# EAGLE schematic mcat-4cu-b-v2b (EAGLE 6.5.0)

## Sheet 1 of 5
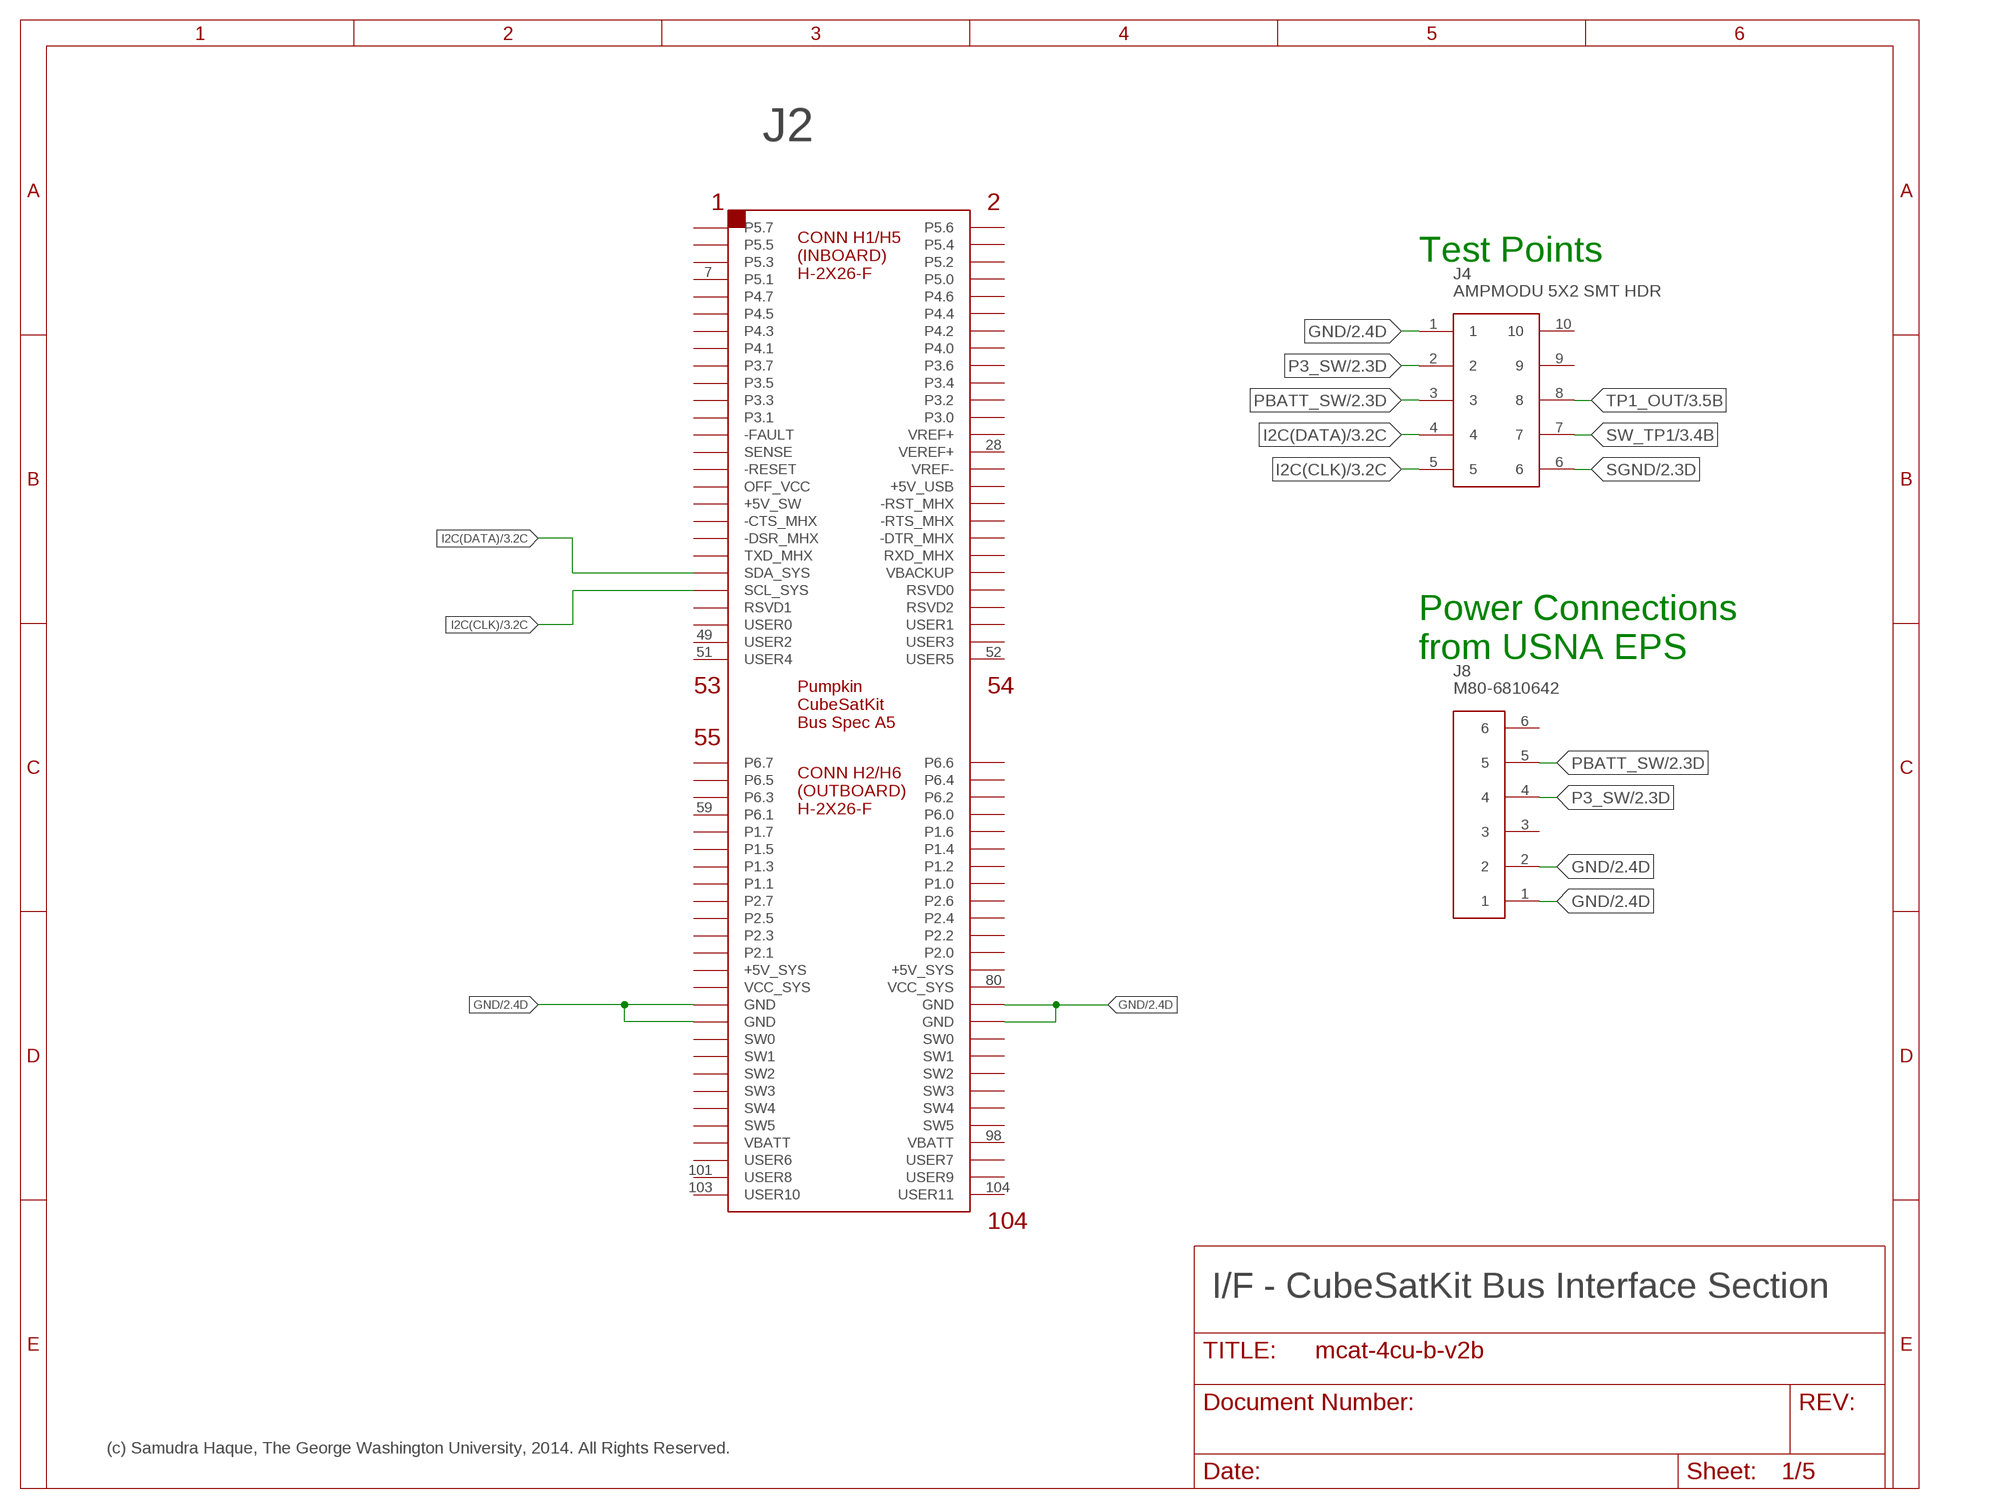
[diagram p0: schematic, sheet 1]

### Parts
J2  CSK-BUS-CONN2X2X26  [CSK-BUS-PKG]
J4  AMPMODU 5X2 SMT HDR  AMPMODU-5-146131-X(5X2)  [AMPMODU-SMT-PIN-HEADER-5X2]
J8  M80-6810642  [M80-68106]

### Nets
GND: J2.81(GND) J2.82(GND) J2.83(GND) J2.84(GND) J4.1 J8.1 J8.2 ; also sheet 2,3
I2C(CLK): J2.43(SCL_SYS) J4.5 ; also sheet 3
I2C(DATA): J2.41(SDA_SYS) J4.4 ; also sheet 3
P3_SW: J4.2 J8.4 ; also sheet 2
PBATT_SW [vin2a2ozcu]: J4.3 J8.5 ; also sheet 2
SGND: J4.6 ; also sheet 2,3,4,5
SW_TP1: J4.7 ; also sheet 3
TP1_OUT: J4.8 ; also sheet 3,5
Unconnected: J2.1(P5.7) J2.2(P5.6) J2.3(P5.5) J2.4(P5.4) J2.5(P5.3) J2.6(P5.2) J2.7(P5.1) J2.8(P5.0) J2.9(P4.7) J2.10(P4.6) J2.11(P4.5) J2.12(P4.4) J2.13(P4.3) J2.14(P4.2) J2.15(P4.1) J2.16(P4.0) J2.17(P3.7) J2.18(P3.6) J2.19(P3.5) J2.20(P3.4) J2.21(P3.3) J2.22(P3.2) J2.23(P3.1) J2.24(P3.0) J2.25(-FAULT) J2.26(VREF+) J2.27(SENSE) J2.28(VEREF+) J2.29(-RESET) J2.30(VREF-) J2.31(OFF_VCC) J2.32(+5V_USB) J2.33(+5V_SW) J2.34(-RST_MHX) J2.35(-CTS_MHX) J2.36(-RTS_MHX) J2.37(-DSR_MHX) J2.38(-DTR_MHX) J2.39(TXD_MHX) J2.40(RXD_MHX) J2.42(VBACKUP) J2.44(RSVD0) J2.45(RSVD1) J2.46(RSVD2) J2.47(USER0) J2.48(USER1) J2.49(USER2) J2.50(USER3) J2.51(USER4) J2.52(USER5) J2.53(P6.7) J2.54(P6.6) J2.55(P6.5) J2.56(P6.4) J2.57(P6.3) J2.58(P6.2) J2.59(P6.1) J2.60(P6.0) J2.61(P1.7) J2.62(P1.6) J2.63(P1.5) J2.64(P1.4) J2.65(P1.3) J2.66(P1.2) J2.67(P1.1) J2.68(P1.0) J2.69(P2.7) J2.70(P2.6) J2.71(P2.5) J2.72(P2.4) J2.73(P2.3) J2.74(P2.2) J2.75(P2.1) J2.76(P2.0) J2.77(+5V_SYS) J2.78(+5V_SYS) J2.79(VCC_SYS) J2.80(VCC_SYS) J2.85(SW0) J2.86(SW0) J2.87(SW1) J2.88(SW1) J2.89(SW2) J2.90(SW2) J2.91(SW3) J2.92(SW3) J2.93(SW4) J2.94(SW4) J2.95(SW5) J2.96(SW5) J2.97(VBATT) J2.98(VBATT) J2.99(USER6) J2.100(USER7) J2.101(USER8) J2.102(USER9) J2.103(USER10) J2.104(USER11) J4.9 J4.10 J8.3 J8.6

### Notes on the sheet
- Test Points
- Power Connections
  from USNA EPS
- I/F - CubeSatKit Bus Interface Section
- (c) Samudra Haque, The George Washington University, 2014. All Rights Reserved.

## Sheet 2 of 5
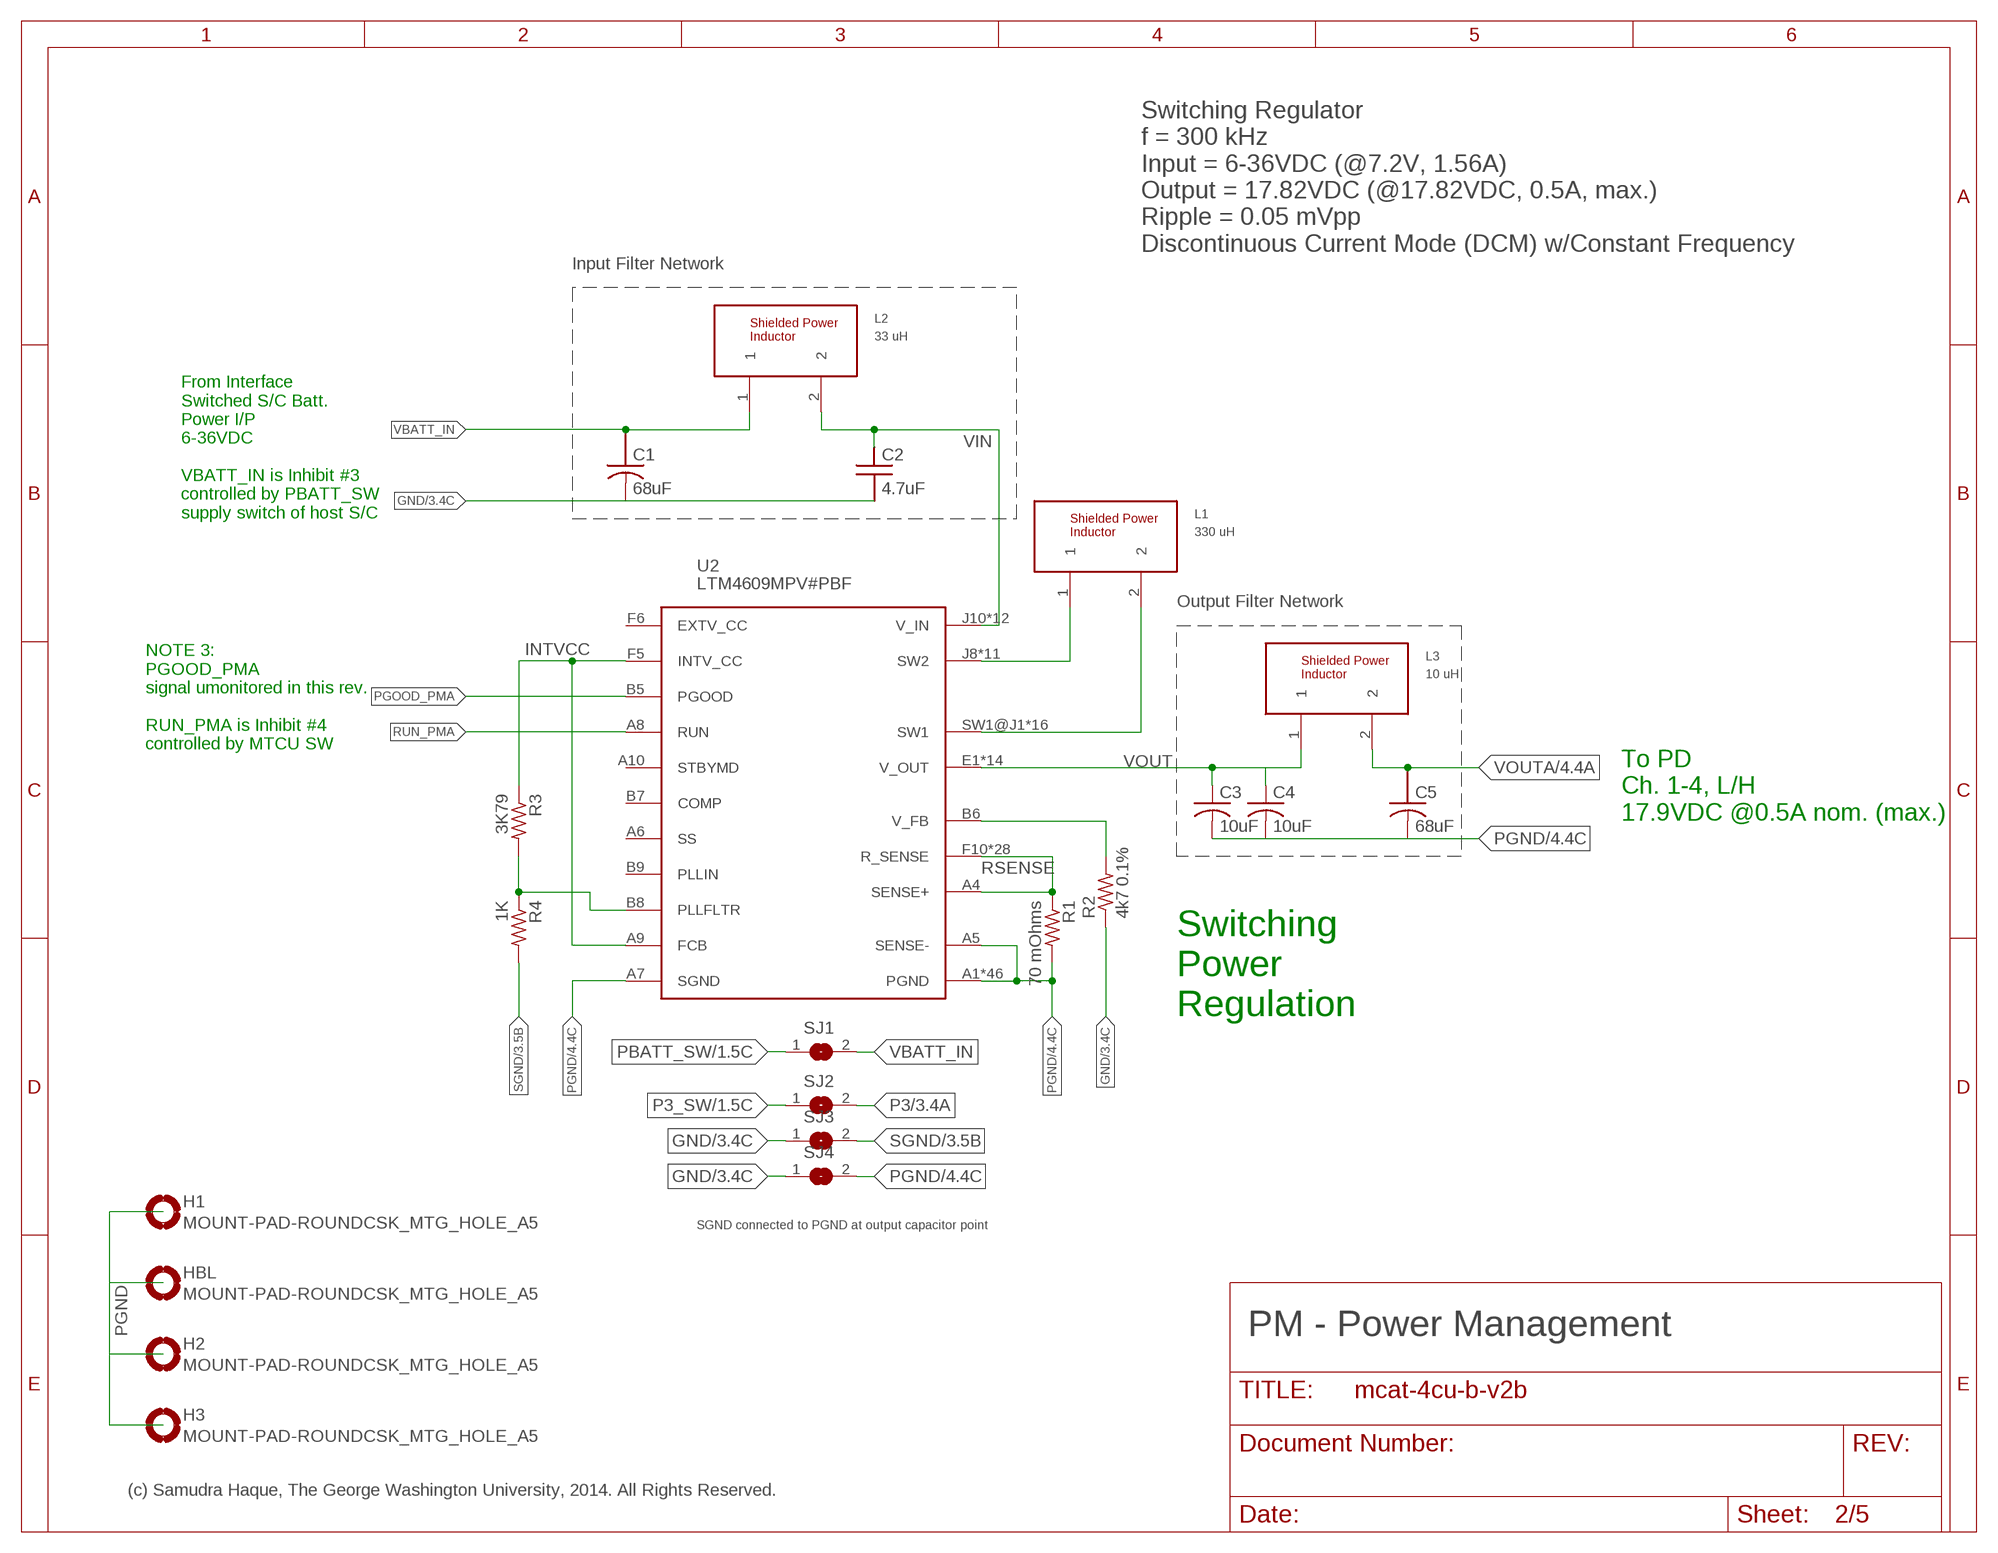
[diagram p1: schematic, sheet 2]

### Parts
C1  68uF  OSCON-50SVPF68M  [OS-CON-SVPF-F12]
C2  4.7uF  AVX-LD105C475KAB2A  [MLCC-X7R-1210]
C3  10uF  C-USC1210K  [C1210K]
C4  10uF  C-USC1210K  [C1210K]
C5  68uF  OSCON-50SVPF68M  [OS-CON-SVPF-F12]
H1  MOUNT-PAD-ROUNDCSK_MTG_HOLE_A5  [CSK_MOUNTING_HOLE]
H2  MOUNT-PAD-ROUNDCSK_MTG_HOLE_A5  [CSK_MOUNTING_HOLE]
H3  MOUNT-PAD-ROUNDCSK_MTG_HOLE_A5  [CSK_MOUNTING_HOLE]
HBL  MOUNT-PAD-ROUNDCSK_MTG_HOLE_A5  [CSK_MOUNTING_HOLE]
L1  330 uH  MSS1048-334KL_  [MSS1048]
L2  33 uH  MSS1038-333ML_  [MSS1048]
L3  10 uH  ELL-5PS100M  [SERIES-POWER-INDUCTORS]
R1  70 mOhms  R-US_R1206  [R1206]
R2  4k7 0.1%  R-US_R0603  [R0603]
R3  3K79  R-US_R0805  [R0805]
R4  1K  R-US_R0805  [R0805]
SJ1  SJ  [SJ]
SJ2  SJ  [SJ]
SJ3  SJ  [SJ]
SJ4  SJ  [SJ]
U2  LTM4609MPV#PBF  LTM4609MPV#PBFROHS/HITEMP  [LGA-141-LTC-05-08-1840-B]

### Nets
GND: C1.K1(K) C2.2 R2.1 SJ3.1 SJ4.1 ; also sheet 1,3
INTVCC: R3.1 U2.A9(FCB) U2.F5(INTV_CC) ; also sheet 3
N$8: R2.2 U2.B6(V_FB)
P3: SJ2.2 ; also sheet 3
P3_SW: SJ2.1 ; also sheet 1
PBATT_SW [vin2a2ozcu]: SJ1.1 ; also sheet 1
PGND: C3.2 C4.2 C5.K1(K) H1.P$1(MOUNT) H2.P$1(MOUNT) H3.P$1(MOUNT) HBL.P$1(MOUNT) R1.2 SJ4.2 U2.A1(PGND) U2.A2(PGND) U2.A3(PGND) U2.A5(SENSE-) U2.A7(SGND) U2.A11(PGND) U2.A12(PGND) U2.B1(PGND) U2.B2(PGND) U2.B3(PGND) U2.B4(PGND) U2.B10(PGND) U2.B11(PGND) U2.B12(PGND) U2.C1(PGND) U2.C2(PGND) U2.C3(PGND) U2.C4(PGND) U2.C5(PGND) U2.C6(PGND) U2.C7(PGND) U2.C8(PGND) U2.C9(PGND) U2.C10(PGND) U2.C11(PGND) U2.C12(PGND) U2.D1(PGND) U2.D2(PGND) U2.D3(PGND) U2.D4(PGND) U2.D5(PGND) U2.D6(PGND) U2.D7(PGND) U2.D8(PGND) U2.D9(PGND) U2.D10(PGND) U2.D11(PGND) U2.D12(PGND) U2.E3(PGND) U2.E4(PGND) U2.E5(PGND) U2.E6(PGND) U2.E7(PGND) U2.E8(PGND) U2.E9(PGND) U2.E10(PGND) U2.E11(PGND) U2.E12(PGND) ; also sheet 4,5
PGOOD_PMA: U2.B5(PGOOD)
RSENSE: R1.1 U2.A4(SENSE+) U2.F10(R_SENSE) U2.F11(R_SENSE) U2.F12(R_SENSE) U2.G5(R_SENSE) U2.G6(R_SENSE) U2.G7(R_SENSE) U2.G8(R_SENSE) U2.G9(R_SENSE) U2.G10(R_SENSE) U2.G11(R_SENSE) U2.G12(R_SENSE) U2.H5(R_SENSE) U2.H6(R_SENSE) U2.H7(R_SENSE) U2.H8(R_SENSE) U2.H9(R_SENSE) U2.H10(R_SENSE) U2.H11(R_SENSE) U2.H12(R_SENSE) U2.J5(R_SENSE) U2.J6(R_SENSE) U2.J7(R_SENSE) U2.K5(R_SENSE) U2.K6(R_SENSE) U2.L5(R_SENSE) U2.L6(R_SENSE) U2.M5(R_SENSE) U2.M6(R_SENSE)
RUN_PMA: U2.A8(RUN)
SETFREQ: R3.2 R4.1 U2.B8(PLLFLTR)
SGND: R4.2 SJ3.2 ; also sheet 1,3,4,5
SW1: L1.2 U2.SW1@J1(SW1) U2.SW1@J2(SW1) U2.SW1@J3(SW1) U2.SW1@J4(SW1) U2.SW1@K1(SW1) U2.SW1@K2(SW1) U2.SW1@K3(SW1) U2.SW1@K4(SW1) U2.SW1@L1(SW1) U2.SW1@L2(SW1) U2.SW1@L3(SW1) U2.SW1@L4(SW1) U2.SW1@M1(SW1) U2.SW1@M2(SW1) U2.SW1@M3(SW1) U2.SW1@M4(SW1)
SW2: L1.1 U2.J8(SW2) U2.J9(SW2) U2.K7(SW2) U2.K8(SW2) U2.K9(SW2) U2.L7(SW2) U2.L8(SW2) U2.L9(SW2) U2.M7(SW2) U2.M8(SW2) U2.M9(SW2)
VBATT_IN [vin2a2ozcu]: C1.A1(A) L2.1 SJ1.2
VIN: C2.1 L2.2 U2.J10(V_IN) U2.J11(V_IN) U2.J12(V_IN) U2.K10(V_IN) U2.K11(V_IN) U2.K12(V_IN) U2.L10(V_IN) U2.L11(V_IN) U2.L12(V_IN) U2.M10(V_IN) U2.M11(V_IN) U2.M12(V_IN)
VOUT [vout1a2ozcu]: C3.1 C4.1 L3.1 U2.E1(V_OUT) U2.E2(V_OUT) U2.F1(V_OUT) U2.F2(V_OUT) U2.F3(V_OUT) U2.F4(V_OUT) U2.G1(V_OUT) U2.G2(V_OUT) U2.G3(V_OUT) U2.G4(V_OUT) U2.H2(V_OUT) U2.H3(V_OUT) U2.H4(V_OUT) U2.VOUT(V_OUT)
VOUTA [vout1a2ozcu]: C5.A1(A) L3.2 ; also sheet 4,5
Unconnected: U2.A6(SS) U2.A10(STBYMD) U2.B7(COMP) U2.B9(PLLIN) U2.F6(EXTV_CC)

### Notes on the sheet
- Switching Regulator
  f = 300 kHz
  Input = 6-36VDC (@7.2V, 1.56A)
  Output = 17.82VDC (@17.82VDC, 0.5A, max.)
  Ripple = 0.05 mVpp
  Discontinuous Current Mode (DCM) w/Constant Frequency
- Input Filter Network
- From Interface
  Switched S/C Batt. 
  Power I/P
  6-36VDC
  
  VBATT_IN is Inhibit #3
  controlled by PBATT_SW
  supply switch of host S/C
- Output Filter Network
- NOTE 3:
  PGOOD_PMA
  signal umonitored in this rev.
  
  RUN_PMA is Inhibit #4
  controlled by MTCU SW
- To PD
  Ch. 1-4, L/H
  17.9VDC @0.5A nom. (max.)
- Switching 
  Power 
  Regulation
- SGND connected to PGND at output capacitor point
- PM - Power Management
- (c) Samudra Haque, The George Washington University, 2014. All Rights Reserved.

## Sheet 3 of 5
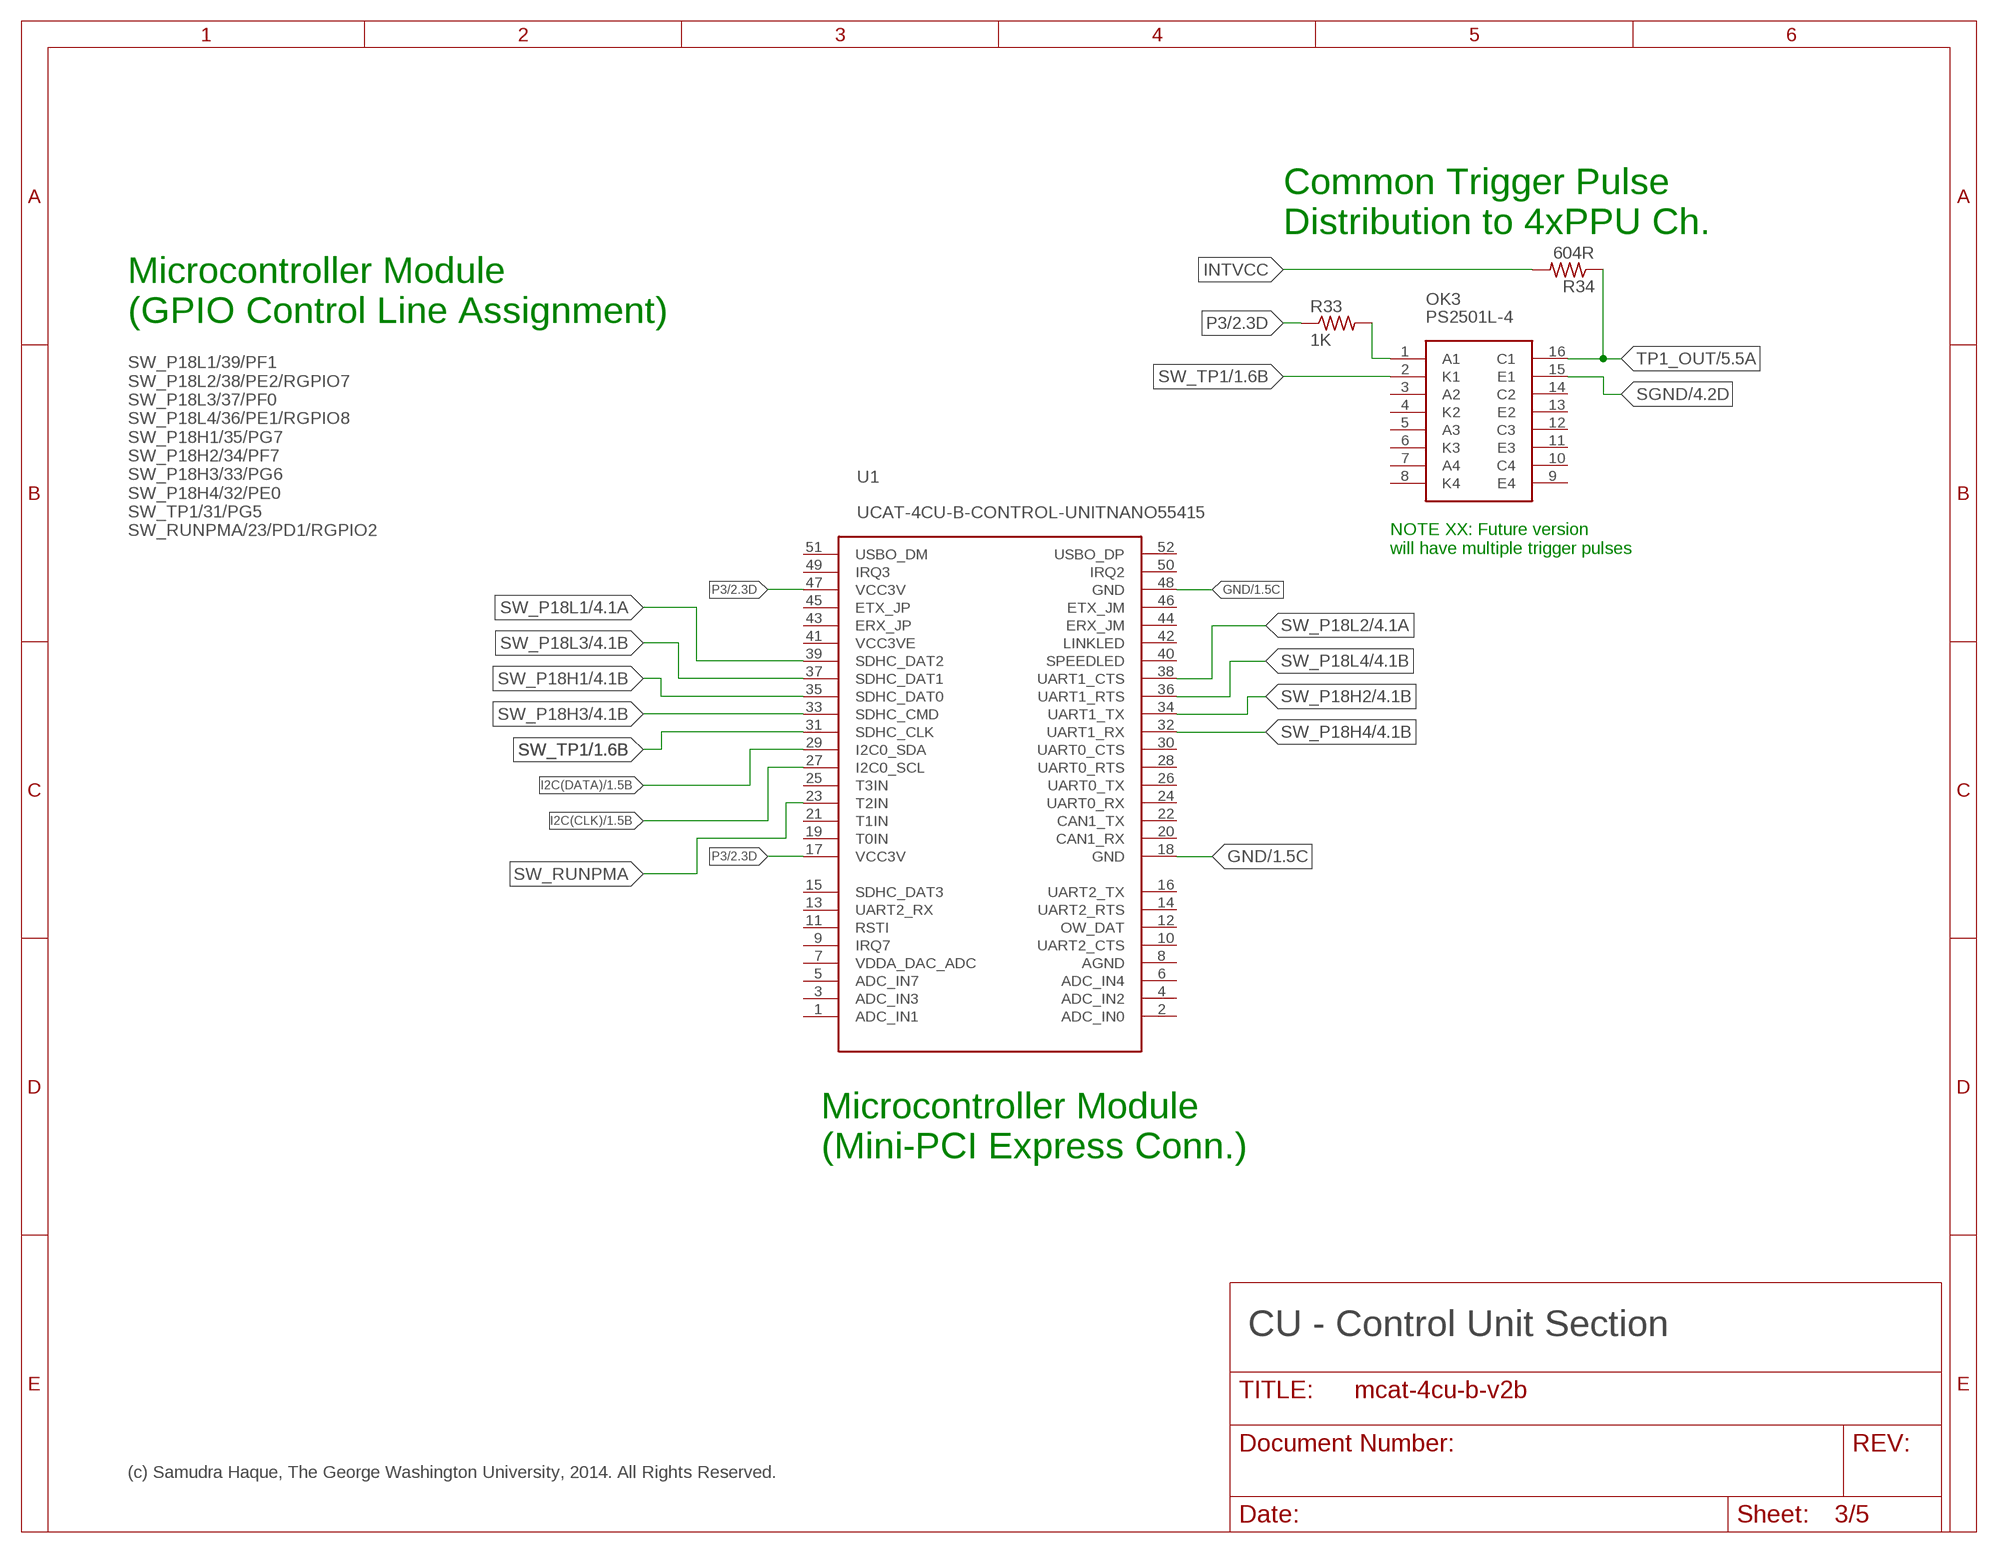
[diagram p2: schematic, sheet 3]

### Parts
OK3  PS2501L-4  [PS2501L-4]
R33  1K  R-US_R0805  [R0805]
R34  604R  R-US_R0805  [R0805]
U1  UCAT-4CU-B-CONTROL-UNITNANO55415  [MOLEX-MINI-PCI-EXPRESS-8MM-52CKT]

### Nets
GND: U1.18(GND) U1.48(GND) ; also sheet 1,2
I2C(CLK): U1.27(I2C0_SCL) ; also sheet 1
I2C(DATA): U1.29(I2C0_SDA) ; also sheet 1
INTVCC: R34.2 ; also sheet 2
N$16: OK3.1(A1) R33.2
P3: R33.1 U1.17(VCC3V) U1.47(VCC3V) ; also sheet 2
SGND: OK3.15(E1) ; also sheet 1,2,4,5
SW_P18H1: U1.35(SDHC_DAT0) ; also sheet 4
SW_P18H2: U1.34(UART1_TX) ; also sheet 4
SW_P18H3: U1.33(SDHC_CMD) ; also sheet 4
SW_P18H4: U1.32(UART1_RX) ; also sheet 4
SW_P18L1: U1.39(SDHC_DAT2) ; also sheet 4
SW_P18L2: U1.38(UART1_CTS) ; also sheet 4
SW_P18L3: U1.37(SDHC_DAT1) ; also sheet 4
SW_P18L4: U1.36(UART1_RTS) ; also sheet 4
SW_RUNPMA: U1.23(T2IN)
SW_TP1: OK3.2(K1) U1.31(SDHC_CLK) ; also sheet 1
TP1_OUT: OK3.16(C1) R34.1 ; also sheet 1,5
Unconnected: OK3.3(A2) OK3.4(K2) OK3.5(A3) OK3.6(K3) OK3.7(A4) OK3.8(K4) OK3.9(E4) OK3.10(C4) OK3.11(E3) OK3.12(C3) OK3.13(E2) OK3.14(C2) U1.1(ADC_IN1) U1.2(ADC_IN0) U1.3(ADC_IN3) U1.4(ADC_IN2) U1.5(ADC_IN7) U1.6(ADC_IN4) U1.7(VDDA_DAC_ADC) U1.8(AGND) U1.9(IRQ7) U1.10(UART2_CTS) U1.11(RSTI) U1.12(OW_DAT) U1.13(UART2_RX) U1.14(UART2_RTS) U1.15(SDHC_DAT3) U1.16(UART2_TX) U1.19(T0IN) U1.20(CAN1_RX) U1.21(T1IN) U1.22(CAN1_TX) U1.24(UART0_RX) U1.25(T3IN) U1.26(UART0_TX) U1.28(UART0_RTS) U1.30(UART0_CTS) U1.40(SPEEDLED) U1.41(VCC3VE) U1.42(LINKLED) U1.43(ERX_JP) U1.44(ERX_JM) U1.45(ETX_JP) U1.46(ETX_JM) U1.49(IRQ3) U1.50(IRQ2) U1.51(USBO_DM) U1.52(USBO_DP)

### Notes on the sheet
- Common Trigger Pulse
  Distribution to 4xPPU Ch.
- Microcontroller Module
  (GPIO Control Line Assignment)
- SW_P18L1/39/PF1
  SW_P18L2/38/PE2/RGPIO7
  SW_P18L3/37/PF0
  SW_P18L4/36/PE1/RGPIO8
  SW_P18H1/35/PG7
  SW_P18H2/34/PF7
  SW_P18H3/33/PG6
  SW_P18H4/32/PE0
  SW_TP1/31/PG5
  SW_RUNPMA/23/PD1/RGPIO2
- NOTE XX: Future version
  will have multiple trigger pulses
- Microcontroller Module
  (Mini-PCI Express Conn.)
- CU - Control Unit Section
- (c) Samudra Haque, The George Washington University, 2014. All Rights Reserved.

## Sheet 4 of 5
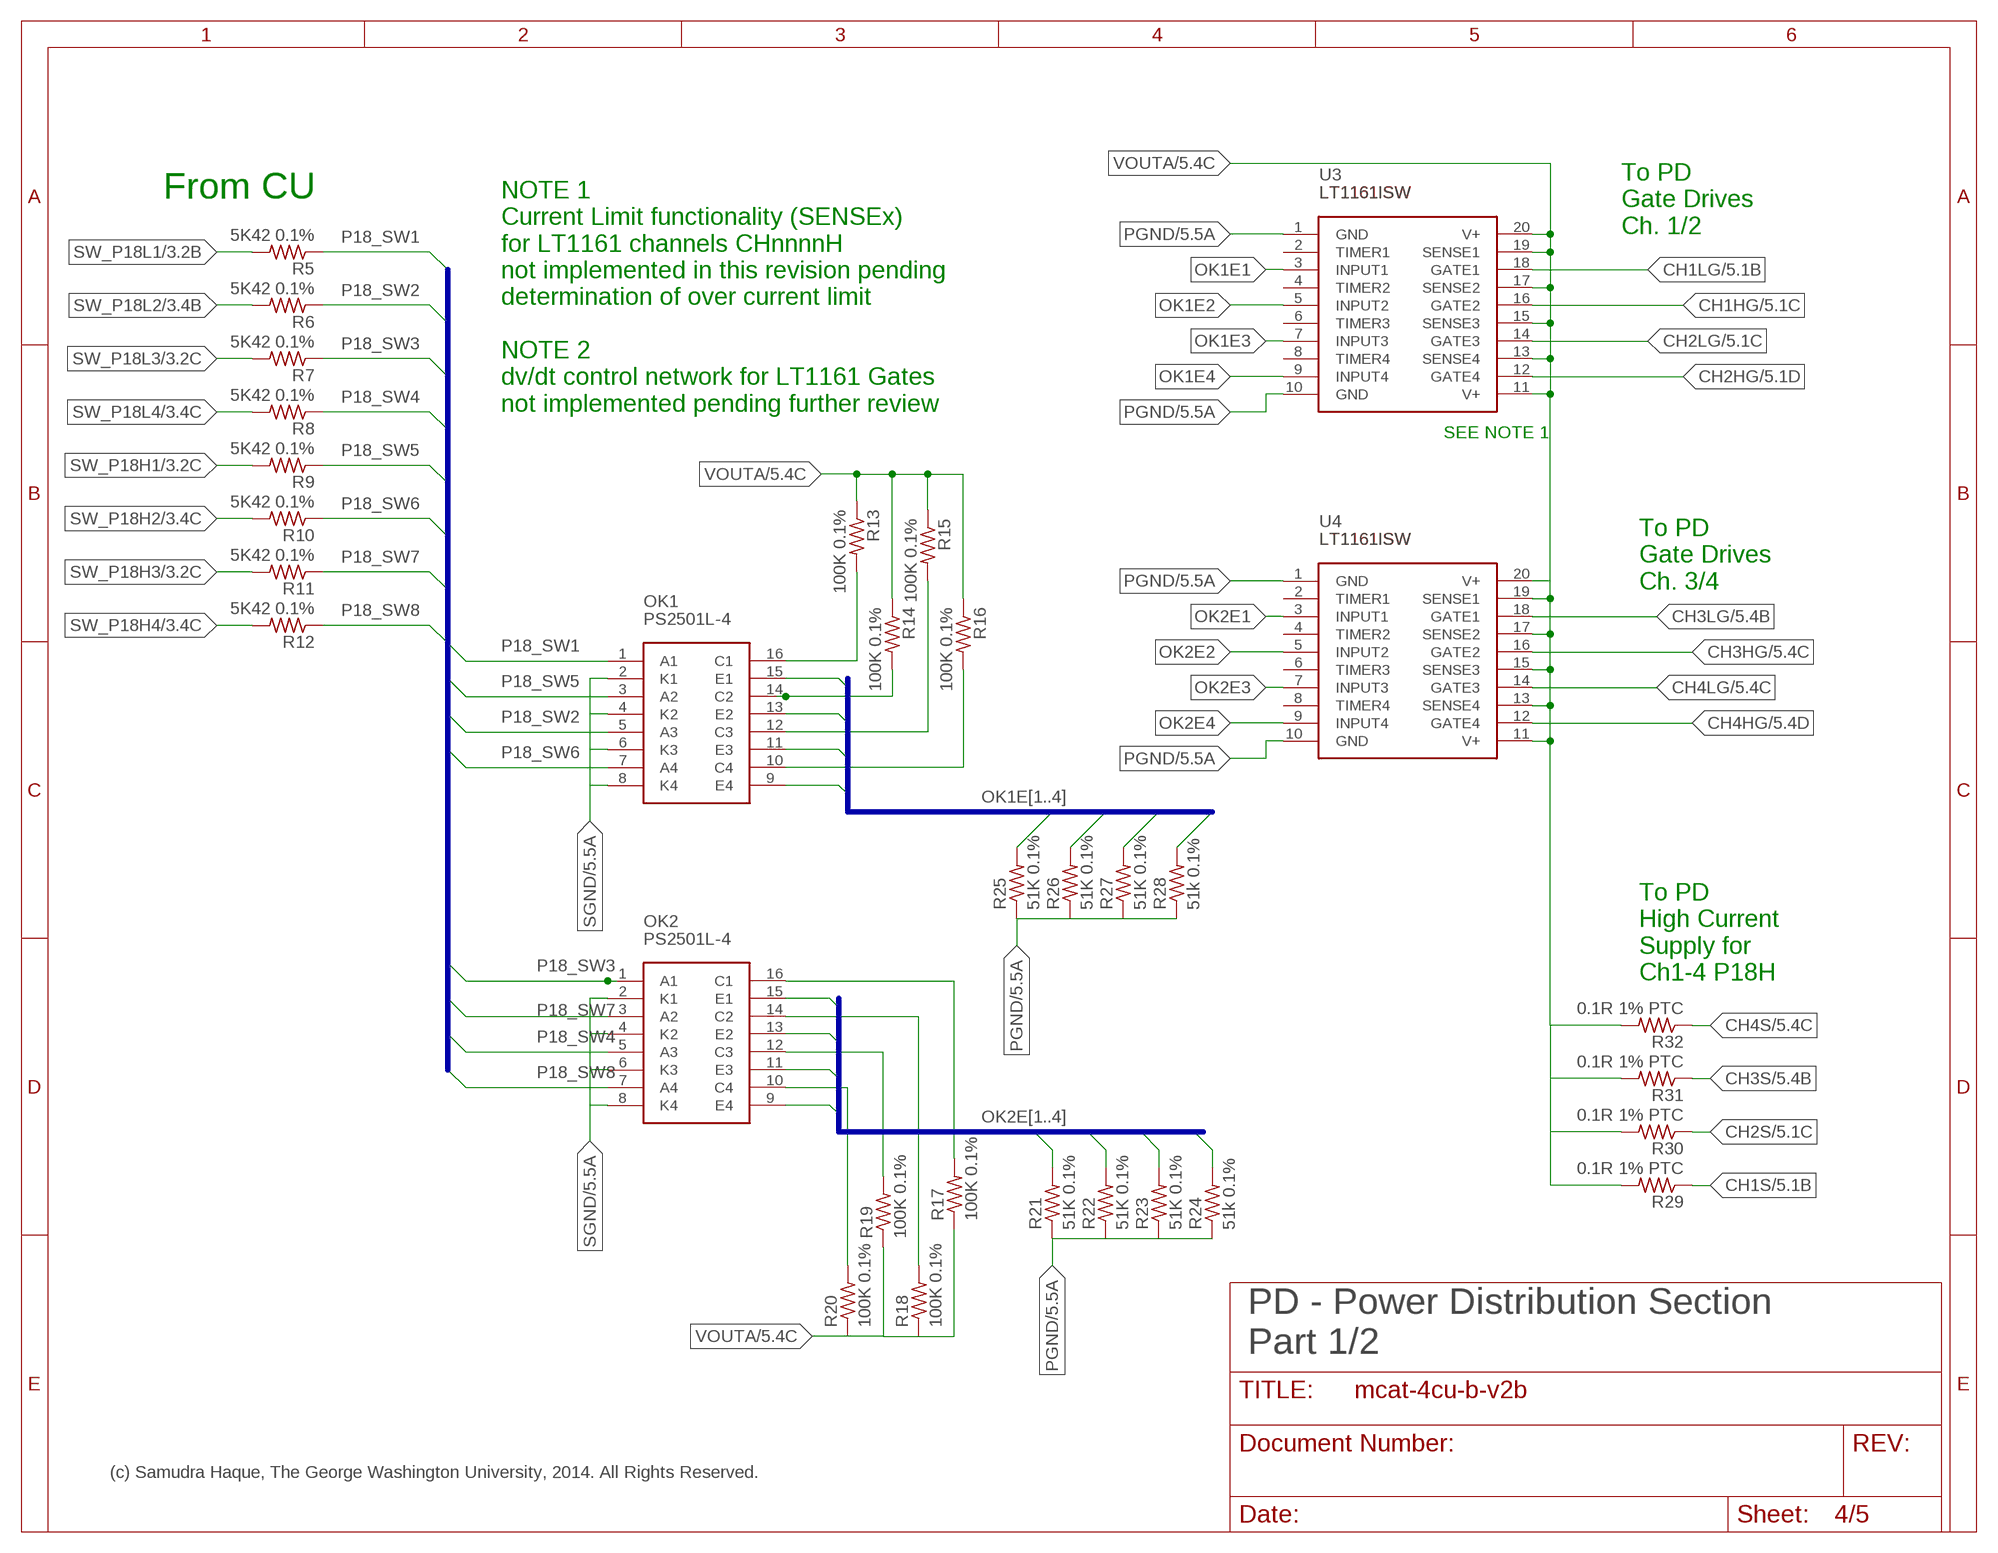
[diagram p3: schematic, sheet 4]

### Parts
OK1  PS2501L-4  [PS2501L-4]
OK2  PS2501L-4  [PS2501L-4]
R5  5K42 0.1%  R-US_R1206  [R1206]
R6  5K42 0.1%  R-US_R1206  [R1206]
R7  5K42 0.1%  R-US_R1206  [R1206]
R8  5K42 0.1%  R-US_R1206  [R1206]
R9  5K42 0.1%  R-US_R1206  [R1206]
R10  5K42 0.1%  R-US_R1206  [R1206]
R11  5K42 0.1%  R-US_R1206  [R1206]
R12  5K42 0.1%  R-US_R1206  [R1206]
R13  100K 0.1%  R-US_R0402  [R0402]
R14  100K 0.1%  R-US_R0402  [R0402]
R15  100K 0.1%  R-US_R0402  [R0402]
R16  100K 0.1%  R-US_R0402  [R0402]
R17  100K 0.1%  R-US_R0402  [R0402]
R18  100K 0.1%  R-US_R0402  [R0402]
R19  100K 0.1%  R-US_R0402  [R0402]
R20  100K 0.1%  R-US_R0402  [R0402]
R21  51K 0.1%  R-US_R0603  [R0603]
R22  51K 0.1%  R-US_R0603  [R0603]
R23  51K 0.1%  R-US_R0603  [R0603]
R24  51k 0.1%  R-US_R0603  [R0603]
R25  51K 0.1%  R-US_R0603  [R0603]
R26  51K 0.1%  R-US_R0603  [R0603]
R27  51K 0.1%  R-US_R0603  [R0603]
R28  51k 0.1%  R-US_R0603  [R0603]
R29  0.1R 1% PTC  R-US_R0402  [R0402]
R30  0.1R 1% PTC  R-US_R0402  [R0402]
R31  0.1R 1% PTC  R-US_R0402  [R0402]
R32  0.1R 1% PTC  R-US_R0402  [R0402]
U3  LT1161ISW  [20-LEAD-PLASTIC-SO]
U4  LT1161ISW  [20-LEAD-PLASTIC-SO]

### Nets
CH1HG: U3.16(GATE2) ; also sheet 5
CH1LG: U3.18(GATE1) ; also sheet 5
CH1S: R29.1 ; also sheet 5
CH2HG: U3.12(GATE4) ; also sheet 5
CH2LG: U3.14(GATE3) ; also sheet 5
CH2S: R30.1 ; also sheet 5
CH3HG: U4.16(GATE2) ; also sheet 5
CH3LG: U4.18(GATE1) ; also sheet 5
CH3S: R31.1 ; also sheet 5
CH4HG: U4.12(GATE4) ; also sheet 5
CH4LG: U4.14(GATE3) ; also sheet 5
CH4S: R32.1 ; also sheet 5
N$4: OK1.16(C1) R13.2
N$5: OK1.14(C2) R14.2
N$7: OK1.12(C3) R15.2
N$9: OK1.10(C4) R16.2
N$10: OK2.16(C1) R17.2
N$11: OK2.14(C2) R18.2
N$12: OK2.12(C3) R19.2
N$13: OK2.10(C4) R20.2
OK1E1: OK1.15(E1) R25.2 U3.3(INPUT1)
OK1E2: OK1.13(E2) R26.2 U3.5(INPUT2)
OK1E3: OK1.11(E3) R27.2 U3.7(INPUT3)
OK1E4: OK1.9(E4) R28.2 U3.9(INPUT4)
OK2E1: OK2.15(E1) R21.2 U4.3(INPUT1)
OK2E2: OK2.13(E2) R22.2 U4.5(INPUT2)
OK2E3: OK2.11(E3) R23.2 U4.7(INPUT3)
OK2E4: OK2.9(E4) R24.2 U4.9(INPUT4)
P18_SW1: OK1.1(A1) R5.1
P18_SW2: OK1.5(A3) R6.1
P18_SW3: OK2.1(A1) R7.1
P18_SW4: OK2.5(A3) R8.1
P18_SW5: OK1.3(A2) R9.1
P18_SW6: OK1.7(A4) R10.1
P18_SW7: OK2.3(A2) R11.1
P18_SW8: OK2.7(A4) R12.1
PGND: R21.1 R22.1 R23.1 R24.1 R25.1 R26.1 R27.1 R28.1 U3.1(GND) U3.10(GND) U4.1(GND) U4.10(GND) ; also sheet 2,5
SGND: OK1.2(K1) OK1.4(K2) OK1.6(K3) OK1.8(K4) OK2.2(K1) OK2.4(K2) OK2.6(K3) OK2.8(K4) ; also sheet 1,2,3,5
SW_P18H1: R9.2 ; also sheet 3
SW_P18H2: R10.2 ; also sheet 3
SW_P18H3: R11.2 ; also sheet 3
SW_P18H4: R12.2 ; also sheet 3
SW_P18L1: R5.2 ; also sheet 3
SW_P18L2: R6.2 ; also sheet 3
SW_P18L3: R7.2 ; also sheet 3
SW_P18L4: R8.2 ; also sheet 3
VOUTA [vout1a2ozcu]: R13.1 R14.1 R15.1 R16.1 R17.1 R18.1 R19.1 R20.1 R29.2 R30.2 R31.2 R32.2 U3.11(V+) U3.13(SENSE4) U3.15(SENSE3) U3.17(SENSE2) U3.19(SENSE1) U3.20(V+) U4.11(V+) U4.13(SENSE4) U4.15(SENSE3) U4.17(SENSE2) U4.19(SENSE1) U4.20(V+) ; also sheet 2,5
Unconnected: U3.2(TIMER1) U3.4(TIMER2) U3.6(TIMER3) U3.8(TIMER4) U4.2(TIMER1) U4.4(TIMER2) U4.6(TIMER3) U4.8(TIMER4)

### Buses
P18_SW[1..8]
OK1E[1..4]
OK2E[1..4]

### Notes on the sheet
- From CU
- To PD
  Gate Drives
  Ch. 1/2
- NOTE 1 
  Current Limit functionality (SENSEx)
  for LT1161 channels CHnnnnH
  not implemented in this revision pending
  determination of over current limit
  
  NOTE 2
  dv/dt control network for LT1161 Gates
  not implemented pending further review
- SEE NOTE 1
- To PD
  Gate Drives
  Ch. 3/4
- To PD
  High Current
  Supply for
  Ch1-4 P18H
- PD - Power Distribution Section
  Part 1/2
- (c) Samudra Haque, The George Washington University, 2014. All Rights Reserved.

## Sheet 5 of 5
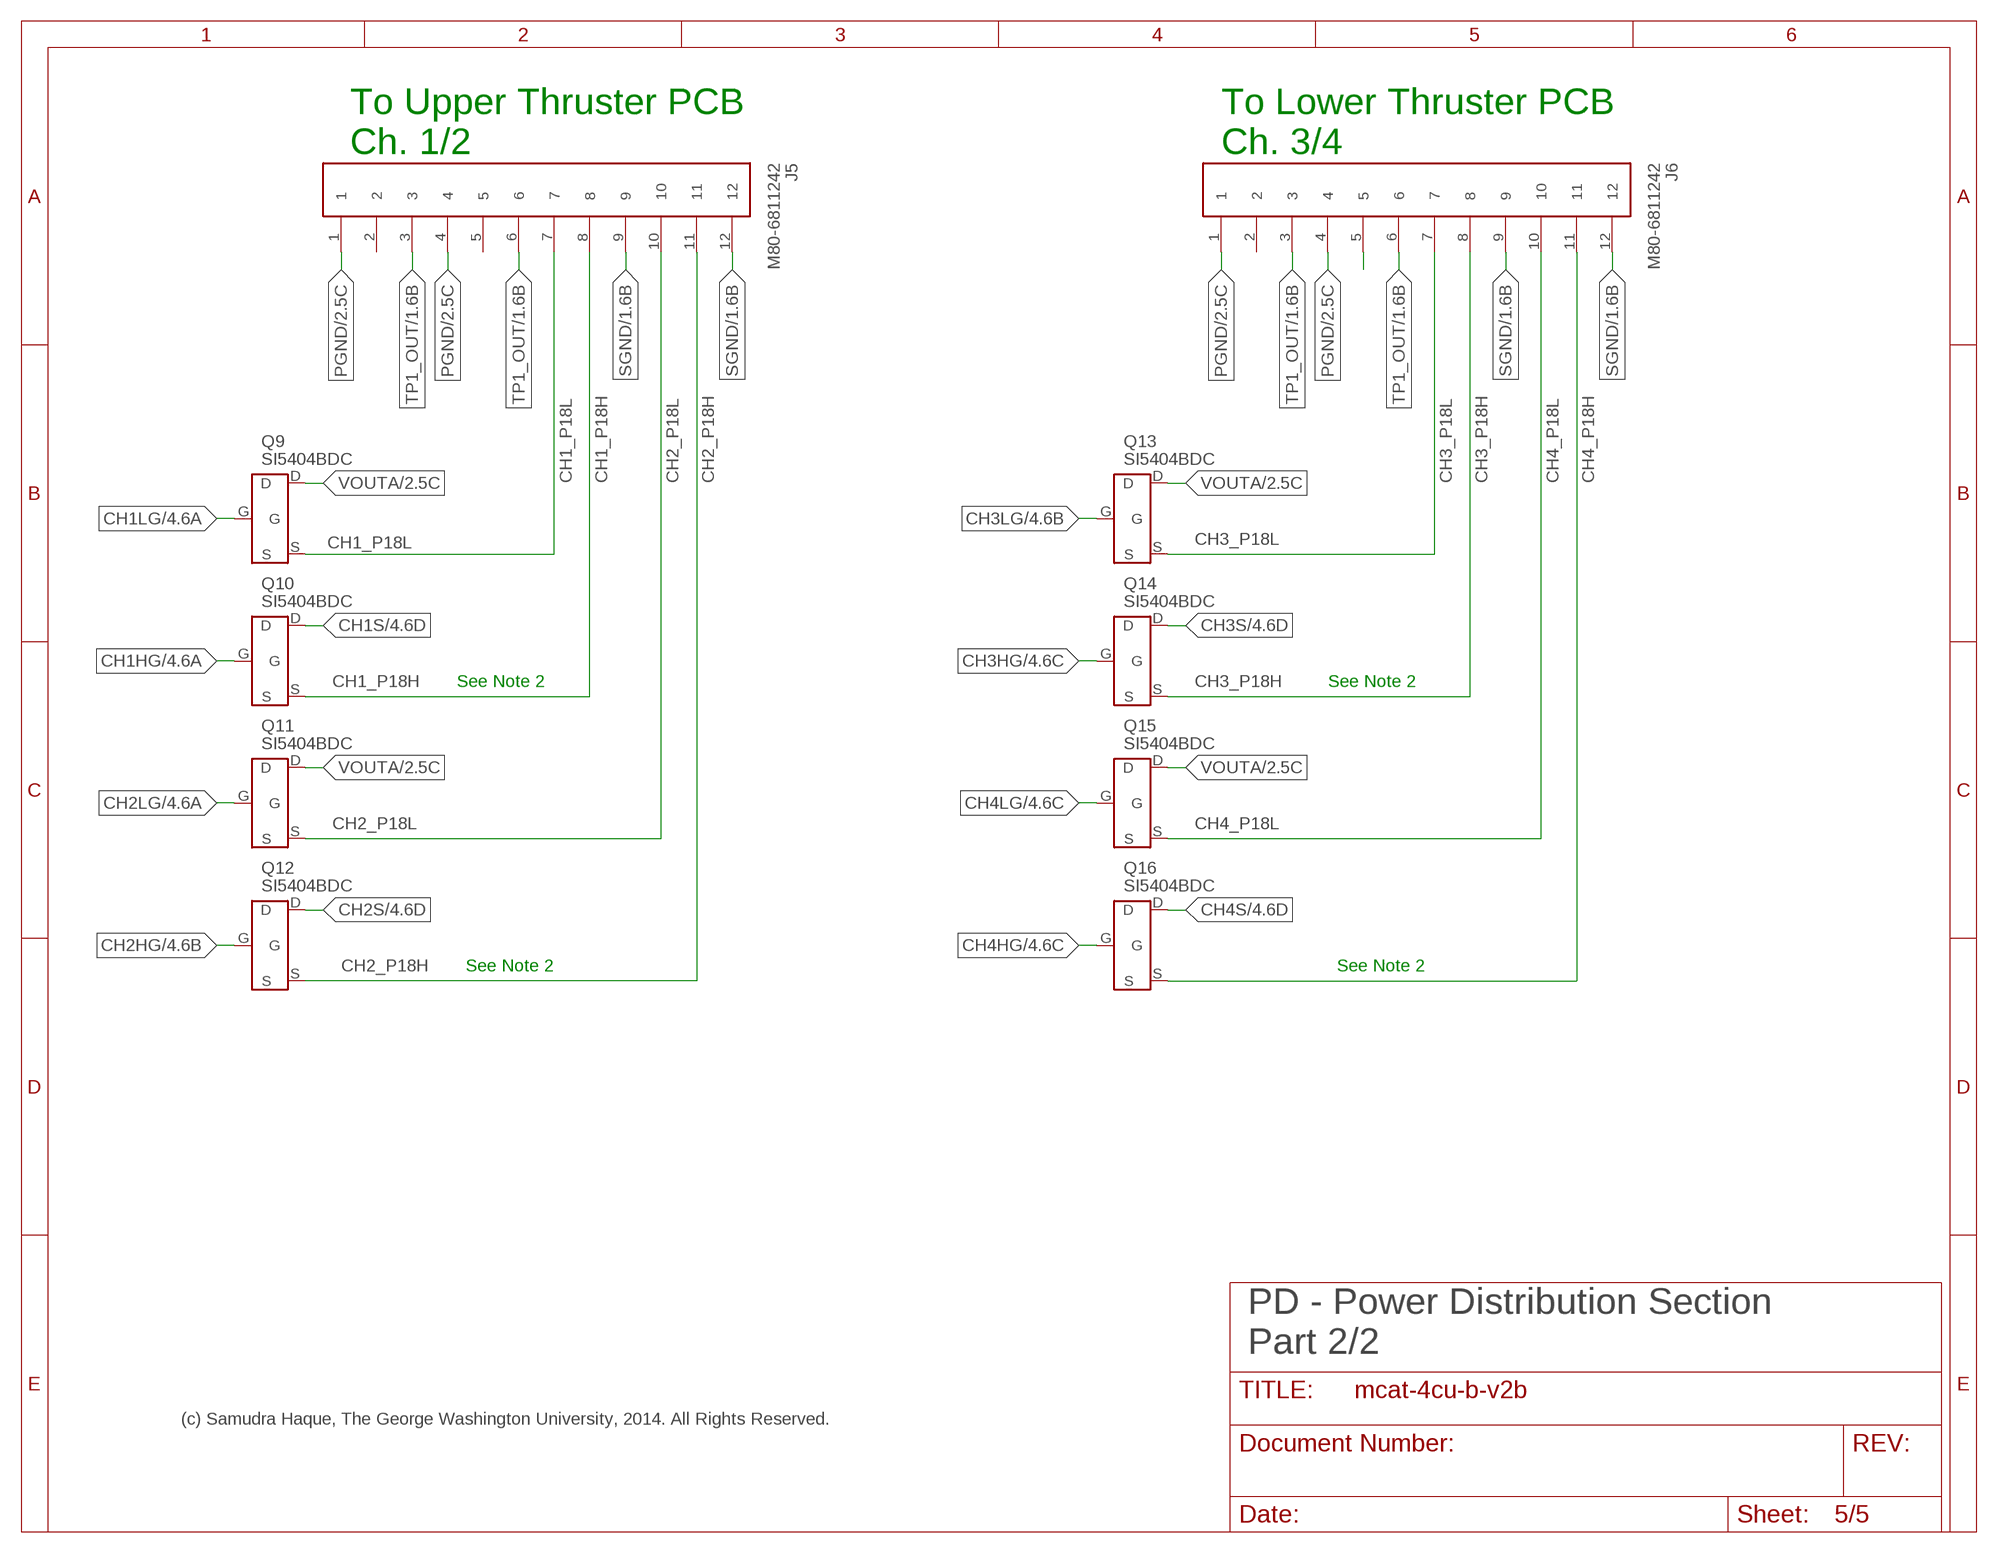
[diagram p4: schematic, sheet 5]

### Parts
J5  M80-6811242  [M80-68112]
J6  M80-6811242  [M80-68112]
Q9  SI5404BDC  [1206-8-CHIPFET]
Q10  SI5404BDC  [1206-8-CHIPFET]
Q11  SI5404BDC  [1206-8-CHIPFET]
Q12  SI5404BDC  [1206-8-CHIPFET]
Q13  SI5404BDC  [1206-8-CHIPFET]
Q14  SI5404BDC  [1206-8-CHIPFET]
Q15  SI5404BDC  [1206-8-CHIPFET]
Q16  SI5404BDC  [1206-8-CHIPFET]

### Nets
CH1_P18H [vout1a2ozcu]: J5.8 Q10.S
CH1_P18L: J5.7 Q9.S
CH1HG: Q10.G ; also sheet 4
CH1LG: Q9.G ; also sheet 4
CH1S: Q10.D ; also sheet 4
CH2_P18H [vout1a2ozcu]: J5.11 Q12.S
CH2_P18L: J5.10 Q11.S
CH2HG: Q12.G ; also sheet 4
CH2LG: Q11.G ; also sheet 4
CH2S: Q12.D ; also sheet 4
CH3_P18H [vout1a2ozcu]: J6.8 Q14.S
CH3_P18L: J6.7 Q13.S
CH3HG: Q14.G ; also sheet 4
CH3LG: Q13.G ; also sheet 4
CH3S: Q14.D ; also sheet 4
CH4_P18H [vout1a2ozcu]: J6.11 Q16.S
CH4_P18L: J6.10 Q15.S
CH4HG: Q16.G ; also sheet 4
CH4LG: Q15.G ; also sheet 4
CH4S: Q16.D ; also sheet 4
N$18: J6.5
PGND: J5.1 J5.4 J6.1 J6.4 ; also sheet 2,4
SGND: J5.9 J5.12 J6.9 J6.12 ; also sheet 1,2,3,4
TP1_OUT: J5.3 J5.6 J6.3 J6.6 ; also sheet 1,3
VOUTA [vout1a2ozcu]: Q9.D Q11.D Q13.D Q15.D ; also sheet 2,4
Unconnected: J5.2 J5.5 J6.2

### Notes on the sheet
- To Upper Thruster PCB
  Ch. 1/2
- To Lower Thruster PCB
  Ch. 3/4
- See Note 2 | See Note 2
- See Note 2 | See Note 2
- PD - Power Distribution Section
  Part 2/2
- (c) Samudra Haque, The George Washington University, 2014. All Rights Reserved.

## Library data of the parts
C1 C5 = gwu_mpnl_ucat_v8:OSCON-50SVPF
C2 = gwu_mpnl_ucat_v8:AVX-LD105C475KAB2A
C3 C4 = rcl:C-US: CAPACITOR, American symbol
H1-H3 HBL = mpnl_holes:MOUNT-PAD-ROUND: MOUNTING PAD, round
J2 = gwu_mpnl_ucat_v8:CSK-BUS-CONN: Cubesat Kit Bus Connector 2 x Samtec ESQ-126-39-G-D Connectors 104 pins per Cubesat Kit Bus Spec A5
J4 = gwu_mpnl_ucat_v8:AMPMODU-5-146131-X(5X2)
J5 J6 = gwu_mpnl_ucat_v8:M80-6811242
J8 = gwu_mpnl_ucat_v8:M80-6810642
L1 = gwu_mpnl_ucat_v8:MSS1048
L2 = gwu_mpnl_ucat_v8:MSS1038
L3 = gwu_mpnl_ucat_v8:ELL-5PS100M; MF: PANASONIC; MPN: ELL5PS100M; OC_FARNELL: 1717452
OK1-OK3 = gwu_mpnl_ucat_v8:PS2501L-4
Q9-Q16 = gwu_mpnl_ucat_v8:SI5404BDC
R1 R2 R5-R28 R33 R34 = resistor:R-US_: RESISTOR, American symbol
R3 R4 R29-R32 = rcl:R-US_: RESISTOR, American symbol
SJ1-SJ4 = jumper:SJ: SMD solder JUMPER
U1 = gwu_mpnl_ucat_v8:UCAT-4CU-B-CONTROL-UNIT
U2 = gwu_mpnl_ucat_v8:LTM4609MPV#PBF: Per LTC Datasheet 4609fe LTM4609 (c) Samudra Haque, N3RDX, 2/23/2014
U3 U4 = gwu_mpnl_ucat_v8:LT1161

## Net classes
0 default: clearance 0.205 mm
1 vout1a2ozcu: width 0.406 mm
2 vin2a2ozcu: width 0.889 mm